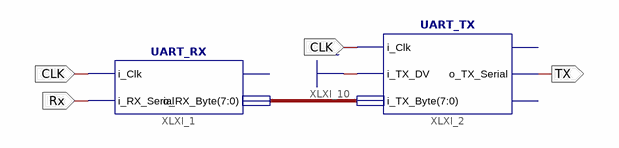
[diagram p0: schematic sheet 1]
// Xilinx ISE schematic transceiver.sch (spartan6) as structural Verilog: 2 symbols, 3 ports
module transceiver (
  input  CLK,
  input  Rx,
  output TX
);

  wire [7:0] XLXN_5;

  UART_TX XLXI_2 (.i_Clk(CLK), .i_TX_DV(1'b1), .i_TX_Byte(XLXN_5), .o_TX_Serial(TX));  // open: o_TX_Active, o_TX_Done
  UART_RX XLXI_1 (.i_Clk(CLK), .i_RX_Serial(Rx), .o_RX_Byte(XLXN_5));  // open: o_RX_DV
endmodule
